# Altium schematic sheet ADP1706_3p3.SchDoc
size A; DocumentNumber: 6; SheetNumber: 6; SheetTotal: 12
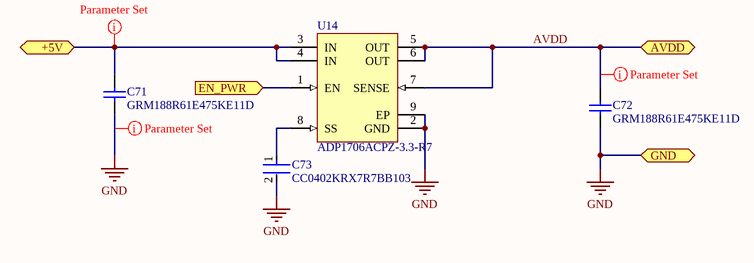
[diagram p0: ADP1706_3p3.SchDoc]

## Parts
C71  GRM188R61E475KE11D  [CAPC1608X90X35LL10T15]
C72  GRM188R61E475KE11D  [CAPC1608X90X35LL10T15]
C73  CC0402KRX7R7BB103  [FP-CC0402-MFG]
U14  ADP1706ACPZ-3.3-R7  [ADI-CP-8-2_L]

## Ports
+5V (bidir), AVDD (bidir), EN_PWR (in), GND (bidir)

## Nets
GND: C71.1 C72.1 C73.2 U14.2(GND) U14.9(EP) ; port GND
+5V: C71.2 U14.3(IN) U14.4(IN) ; port +5V
AVDD: C72.2 U14.5(OUT) U14.6(OUT) U14.7(SENSE) ; port AVDD
EN_PWR: U14.1(EN) ; port EN_PWR
NetC73_1: C73.1 U14.8(SS)

## Layout directives
net class POWER: +5V, AVDD, GND

## Library data of the parts
C71 C72 = CMP-2006-02523-1: Manufacturer: Murata; Part Number: GRM188R61E475KE11D
C73 = CMP-03422-000501-1: CAP CER 10000PF 16V X7R 0402; Manufacturer: YAGEO; Automotive Grade: NA; Capacitance: 10 nF; Material: Ceramic; Value: 10 nF; Tolerance: 0.1; Temperature Coefficient: 30ppm/°C; Temperature Range Low: -55°C; Temperature Range High: +125°C; Mouser Description: 0402 10 nF 16 V ±10 % Tolerance X7R SMT Multilayer Ceramic Capacitor; Footprint Url: http://www.yageo.com/exep/pages/download/literatures/UPY-C_GEN_24.pdf; Category: Cap; RoHS: TRUE; Manufacturer Part Number: CC0402KRX7R7BB103; ComponentLink2Description: Datasheet; Ipc Land Pattern Name: CAPC10050X50; Automotive: No; ComponentLink2URL: http://www.yageo.com/documents/recent/UPY-GP_NP0_16V-to-50V_16.pdf; Device Class L1: Passive Components; Height: 0.55mm; Temperature Characteristic: X7R; Package: CC0402; Voltage Rating: 16 V; Device Class L3: Ceramic Capacitors; Lead Free: Yes; Device Class L2: Capacitors; Digikey Description: CAP CER 10000PF 16V X7R 0402; Octopart: https://octopart.com/cc0402krx7r7bb103-yageo-192895; Temperature: -55°C to +125°C
U14 = CMP-0786-00090-1: 1 A, Low Dropout, CMOS Linear Regulator, 2.5 to 5.5 V Vin, 3.3 V Vout, Industrial, 8-pin QFN (CP-8-2), Reel; Manufacturer: Analog Devices; Vin (max) (V): 5.5; Vin (min) (V): 2.5; Iout max: 1A; Supply Current IGND @ Small Load: 50uA; Preset Vout Values (V): 3.3; Mounting Technology: Surface Mount; PartNumber: ADP1706ACPZ-3.3-R7; ComponentLink3Description: Package Specification; PackageReference: CP-8-2; PackageDescription: 8-Pin Lead Frame Chip Scale Package, Body 3 x 3 mm, Pitch 0.5 mm; ComponentLink1Description: Manufacturer URL; ComponentLink1URL: http://www.analog.com/en/index.html; ComponentLink4Description: URL Link1; ComponentLink2Description: Datasheet; ComponentLink2URL: http://www.analog.com/static/imported-files/data_sheets/ADP1706_1707_1708.pdf; DatasheetVersion: Rev. 0; ComponentLink3URL: http://www.analog.com/static/imported-files/packages/56953322593982CP_8_2.pdf; PackageVersion: 061507-B, 06/2007; Packing: Reel; ComponentLink4URL: Product URL:http://www.analog.com/en/ADP1706/productSearch.html; digikey: https://www.digikey.com/en/products/detail/analog-devices-inc/ADP1706ACPZ-3-3-R7/1662724